# EAGLE design APCBaby8_UIBoard (EAGLE 8.7.0)
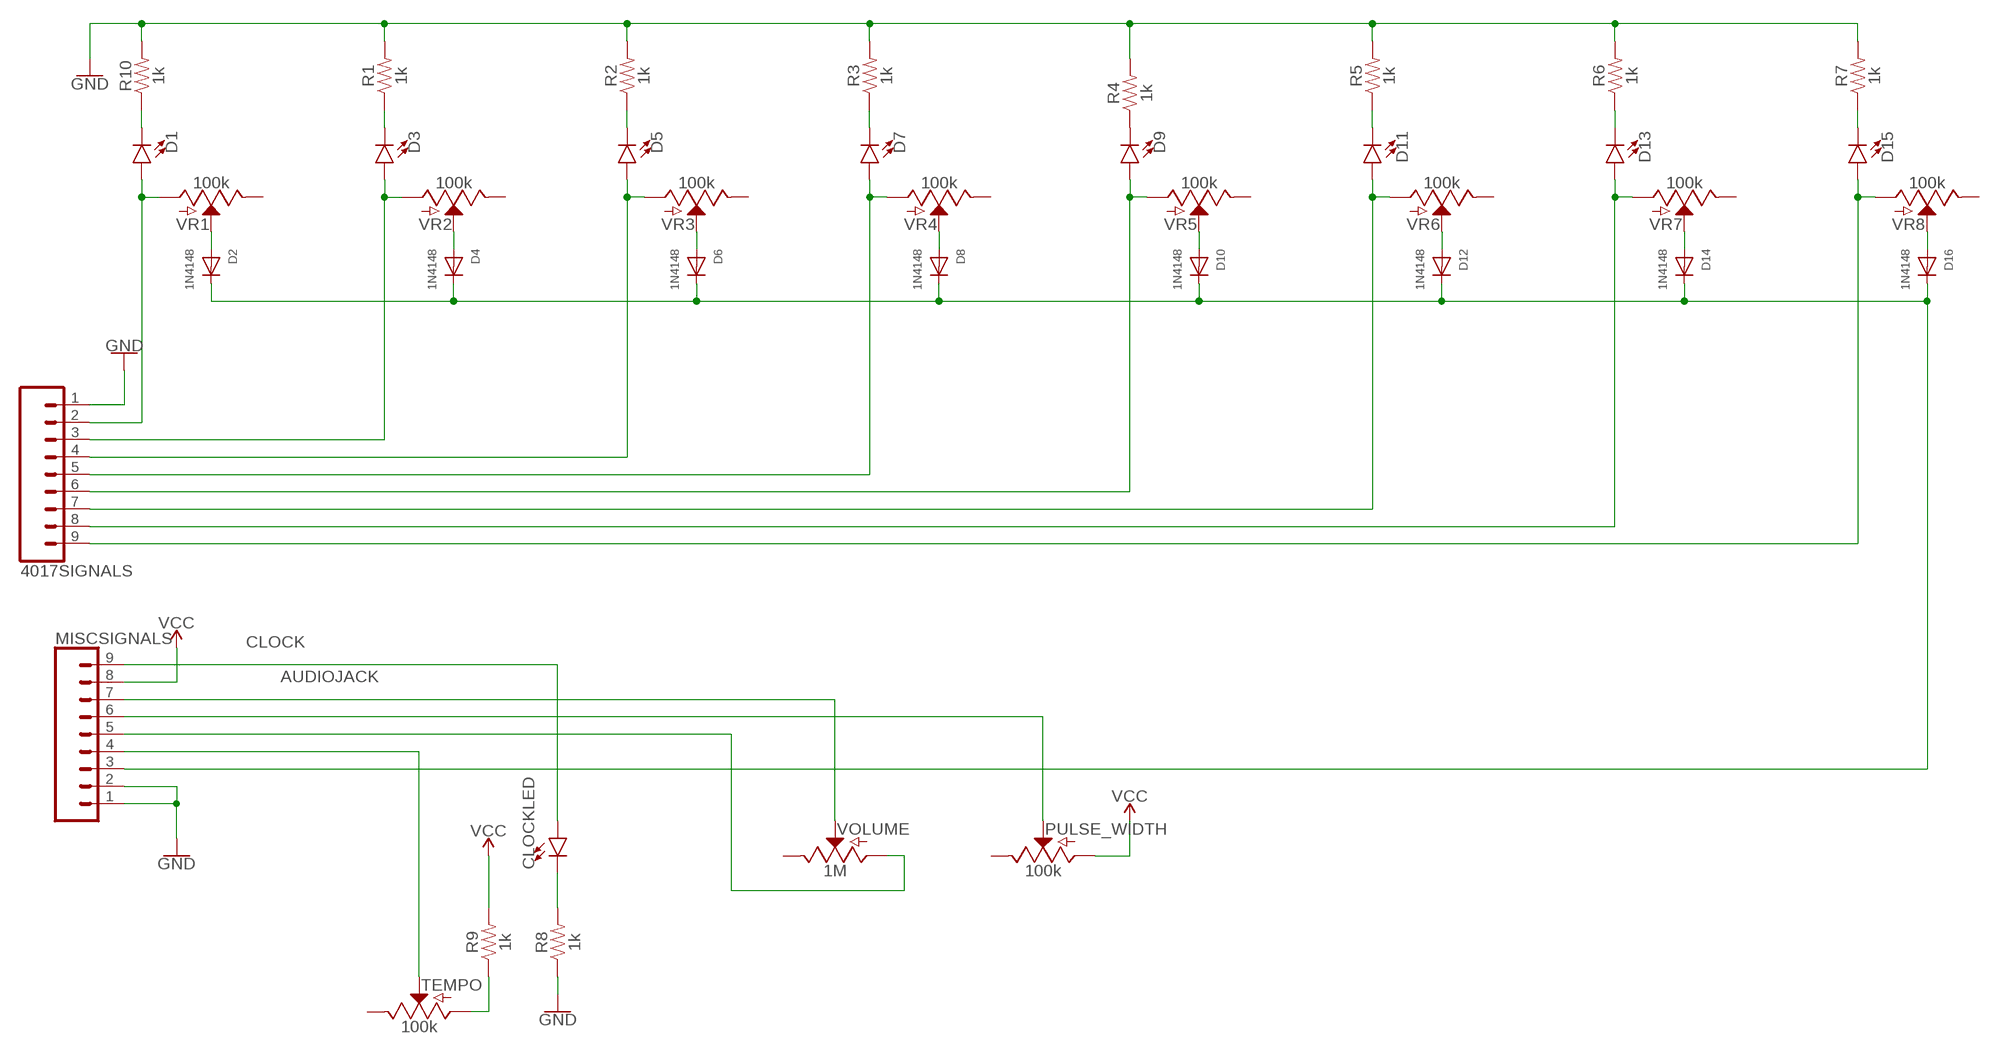
[diagram p0: schematic, sheet 1]

## Parts
4017SIGNALS  CONN_09LONGPADS  [1X09_LONGPADS]
CLOCKLED  LED-3MM-NO_SILK  [LED_3MM-NS]
D1  LED-3MM-NO_SILK  [LED_3MM-NS]
D2  1N4148  DIODEDO-1N4148  [DO-1N4148]
D3  LED-3MM-NO_SILK  [LED_3MM-NS]
D4  1N4148  DIODEDO-1N4148  [DO-1N4148]
D5  LED-3MM-NO_SILK  [LED_3MM-NS]
D6  1N4148  DIODEDO-1N4148  [DO-1N4148]
D7  LED-3MM-NO_SILK  [LED_3MM-NS]
D8  1N4148  DIODEDO-1N4148  [DO-1N4148]
D9  LED-3MM-NO_SILK  [LED_3MM-NS]
D10  1N4148  DIODEDO-1N4148  [DO-1N4148]
D11  LED-3MM-NO_SILK  [LED_3MM-NS]
D12  1N4148  DIODEDO-1N4148  [DO-1N4148]
D13  LED-3MM-NO_SILK  [LED_3MM-NS]
D14  1N4148  DIODEDO-1N4148  [DO-1N4148]
D15  LED-3MM-NO_SILK  [LED_3MM-NS]
D16  1N4148  DIODEDO-1N4148  [DO-1N4148]
MISCSIGNALS  CONN_09LONGPADS  [1X09_LONGPADS]
PULSE_WIDTH  100k  POTENTIOMETER-PTH-9MM-1/20W-20%  [POT-PTH-ALPS]
R1  1k  0.22OHM-0805-1/4W-1%  [0805]
R2  1k  0.22OHM-0805-1/4W-1%  [0805]
R3  1k  0.22OHM-0805-1/4W-1%  [0805]
R4  1k  0.22OHM-0805-1/4W-1%  [0805]
R5  1k  0.22OHM-0805-1/4W-1%  [0805]
R6  1k  0.22OHM-0805-1/4W-1%  [0805]
R7  1k  0.22OHM-0805-1/4W-1%  [0805]
R8  1k  0.22OHM-0805-1/4W-1%  [0805]
R9  1k  0.22OHM-0805-1/4W-1%  [0805]
R10  1k  0.22OHM-0805-1/4W-1%  [0805]
TEMPO  100k  POTENTIOMETER-PTH-9MM-1/20W-20%  [POT-PTH-ALPS]
VOLUME  1M  POTENTIOMETER-PTH-9MM-1/20W-20%  [POT-PTH-ALPS]
VR1  100k  POTENTIOMETER-PTH-9MM-1/20W-20%  [POT-PTH-ALPS]
VR2  100k  POTENTIOMETER-PTH-9MM-1/20W-20%  [POT-PTH-ALPS]
VR3  100k  POTENTIOMETER-PTH-9MM-1/20W-20%  [POT-PTH-ALPS]
VR4  100k  POTENTIOMETER-PTH-9MM-1/20W-20%  [POT-PTH-ALPS]
VR5  100k  POTENTIOMETER-PTH-9MM-1/20W-20%  [POT-PTH-ALPS]
VR6  100k  POTENTIOMETER-PTH-9MM-1/20W-20%  [POT-PTH-ALPS]
VR7  100k  POTENTIOMETER-PTH-9MM-1/20W-20%  [POT-PTH-ALPS]
VR8  100k  POTENTIOMETER-PTH-9MM-1/20W-20%  [POT-PTH-ALPS]

## Nets
AUDIOJACK: MISCSIGNALS.7 VOLUME.P$2(S)
CLOCK: CLOCKLED.A MISCSIGNALS.9
GND: 4017SIGNALS.1 MISCSIGNALS.1 MISCSIGNALS.2 R1.2 R2.2 R3.2 R4.2 R5.2 R6.2 R7.2 R8.1 R10.2
N$1: D9.K(C) R4.1
N$2: D2.A VR1.P$2(S)
N$3: D1.K(C) R10.1
N$4: D4.A VR2.P$2(S)
N$5: D3.K(C) R1.1
N$6: R9.1 TEMPO.P$3(A)
N$8: D6.A VR3.P$2(S)
N$9: D5.K(C) R2.1
N$11: D8.A VR4.P$2(S)
N$12: D7.K(C) R3.1
N$15: D10.A VR5.P$2(S)
N$18: D12.A VR6.P$2(S)
N$19: D11.K(C) R5.1
N$22: D14.A VR7.P$2(S)
N$23: D13.K(C) R6.1
N$25: D16.A VR8.P$2(S)
N$26: D15.K(C) R7.1
N$29: CLOCKLED.K(C) R8.2
PULSESIG: MISCSIGNALS.6 PULSE_WIDTH.P$2(S)
STEP1: 4017SIGNALS.2 D1.A VR1.P$3(A)
STEP2: 4017SIGNALS.3 D3.A VR2.P$3(A)
STEP3: 4017SIGNALS.4 D5.A VR3.P$3(A)
STEP4: 4017SIGNALS.5 D7.A VR4.P$3(A)
STEP5: 4017SIGNALS.6 D9.A VR5.P$3(A)
STEP6: 4017SIGNALS.7 D11.A VR6.P$3(A)
STEP7: 4017SIGNALS.8 D13.A VR7.P$3(A)
STEP8: 4017SIGNALS.9 D15.A VR8.P$3(A)
STEPDIODES: D2.C D4.C D6.C D8.C D10.C D12.C D14.C D16.C MISCSIGNALS.3
TEMPOSIG: MISCSIGNALS.4 TEMPO.P$2(S)
VCC: MISCSIGNALS.8 PULSE_WIDTH.P$3(A) R9.2
VOLSIG: MISCSIGNALS.5 VOLUME.P$3(A)
Unconnected: PULSE_WIDTH.P$1(E) TEMPO.P$1(E) VOLUME.P$1(E) VR1.P$1(E) VR2.P$1(E) VR3.P$1(E) VR4.P$1(E) VR5.P$1(E) VR6.P$1(E) VR7.P$1(E) VR8.P$1(E)

## Library data of the parts
4017SIGNALS MISCSIGNALS = SparkFun-Connectors:CONN_09: Multi connection point. Often used as Generic Header-pin footprint for 0.1 inch spaced/style header connections On any of the 0.1 inch spaced packages, you can populate with these: Break Away Headers - Straight <https://www.sparkfun.com/products/116> (PRT-00116) Break Away Male Headers - Right Angle <https://www.sparkfun.com/products/553> (PRT-00553) Female Headers <https://www.sparkfun.com/products/115> (PRT-00115) Break Away Headers - Machine Pin <https://www.sparkfun.com/products/117> (PRT-00117) Break Away Female Headers - Swiss Machine Pin <https://www.sparkfun.com/products/743> (PRT-00743) For SCREWTERMINALS and SPRING TERMINALS visit here: Screw Terimnals on SparkFun.com <https://www.sparkfun.com/search/results?term=Screw+Terminals> (5mm/3.5mm/2.54mm spacing) This device is also useful as a general connection point to wire up your design to another part of your project. Our various solder wires solder well into these plated through hole pads. Hook-Up Wire - Assortment (Stranded, 22 AWG) <https://www.sparkfun.com/products/11375> (PRT-11375) Hook-Up Wire - Assortment (Solid Core, 22 AWG) <https://www.sparkfun.com/products/11367> (PRT-11367) View the entire wire category on our website here <https://www.sparkfun.com/categories/141> Special notes: Molex polarized connector foot print use with SKU : PRT-08231 with associated crimp pins and housings. 1MM SMD Version SKU: PRT-10208 NOTES ON THE VARIANTS LOCK and LOCK_LONGPADS... This footprint was designed to help hold the alignment of a through-hole component (i.e. 6-pin header) while soldering it into place. You may notice that each hole has been shifted either up or down by 0.005 of an inch from it's more standard position (which is a perfectly straight line). This slight alteration caused the pins (the squares in the middle) to touch the edges of the holes. Because they are alternating, it causes a "brace" to hold the component in place. 0.005 has proven to be the perfect amount of "off-center" position when using our standard breakaway headers. Although looks a little odd when you look at the bare footprint, once you have a header in there, the alteration is very hard to notice. Also,if you push a header all the way into place, it is covered up entirely on the bottom side.
CLOCKLED D1 D3 D5 D7 D9 D11 D13 D15 = SparkFun-LED:LED: LED (Generic) Standard schematic elements and footprints for 5mm, 3mm, 1206, and 0603 sized LEDs. Generic LEDs with no color specified.
D2 D4 D6 D8 D10 D12 D14 D16 = adafruit:DIODE: Diode SMADIODE - SMA Surface Mount Package 20V 1A Schottky Diode Digikey: 641-1014-6-ND DO-1N4148 - Through Hole Small Current Diode SOD-123 20V 1 A (.5mV Vf) Schottky Diode - Digikey: MBRX120TPMSCT-ND SOD-323 10V 570mA (.38mV Vf, 3ns) Schottky Diode - Digikey: ZLLS410CT-ND SOD-523 30V 30mA Schottky Diode (RB751S-40TE61) - Digikey: RB751S-40TE61CT-ND SOT23-R/W - SOT23 Package (R = Solder Paste/Reflow Ovens, W = Hand-Soldering) BAT54Film 40V 300mA - Digikey: 497-7162-1-ND
PULSE_WIDTH TEMPO VOLUME VR1-VR8 = SparkFun-Resistors:POTENTIOMETER: Potentiometer (Pot) Three-terminal potentiometers, with an adjustable wiper and two adjustable resistors. A pot can be used to create a configurable voltage divider, or as a variable resistor. Variants ALPS_POT and ALPS_POT_KIT - PTH, breadboard compatible, 9mm square pots Rotary Potentiometer - Linear (10k ohm) <https://www.sparkfun.com/products/9288> (COM-09288) The KIT variant exposes copper on only one side of the PTH pad, so the part can only be assembled on one side of the PCB. Useful for beginner soldering kits.; PROD_ID: RES-09177; SF_SKU: COM-09288; VALUE: 10k
R1-R10 = SparkFun-Resistors:0.22OHM: 0.22Ω resistor A resistor is a passive two-terminal electrical component that implements electrical resistance as a circuit element. Resistors act to reduce current flow, and, at the same time, act to lower voltage levels within circuits. - Wikipedia; PROD_ID: RES-09883; VALUE: 0.22

## Board
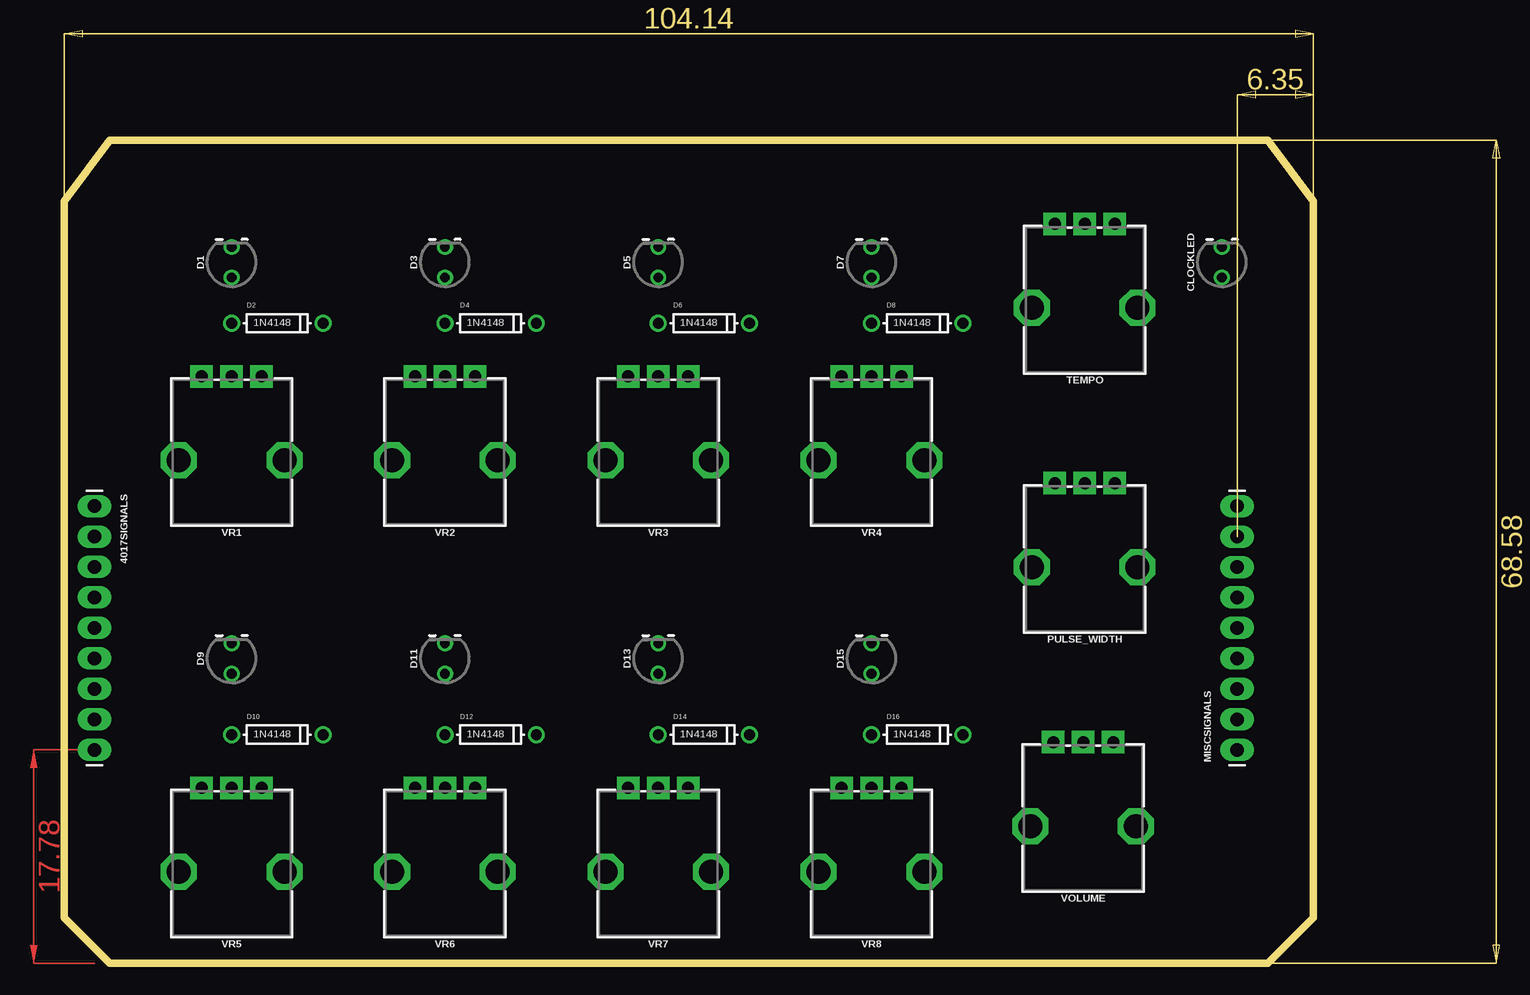
[diagram p1: board, top side]
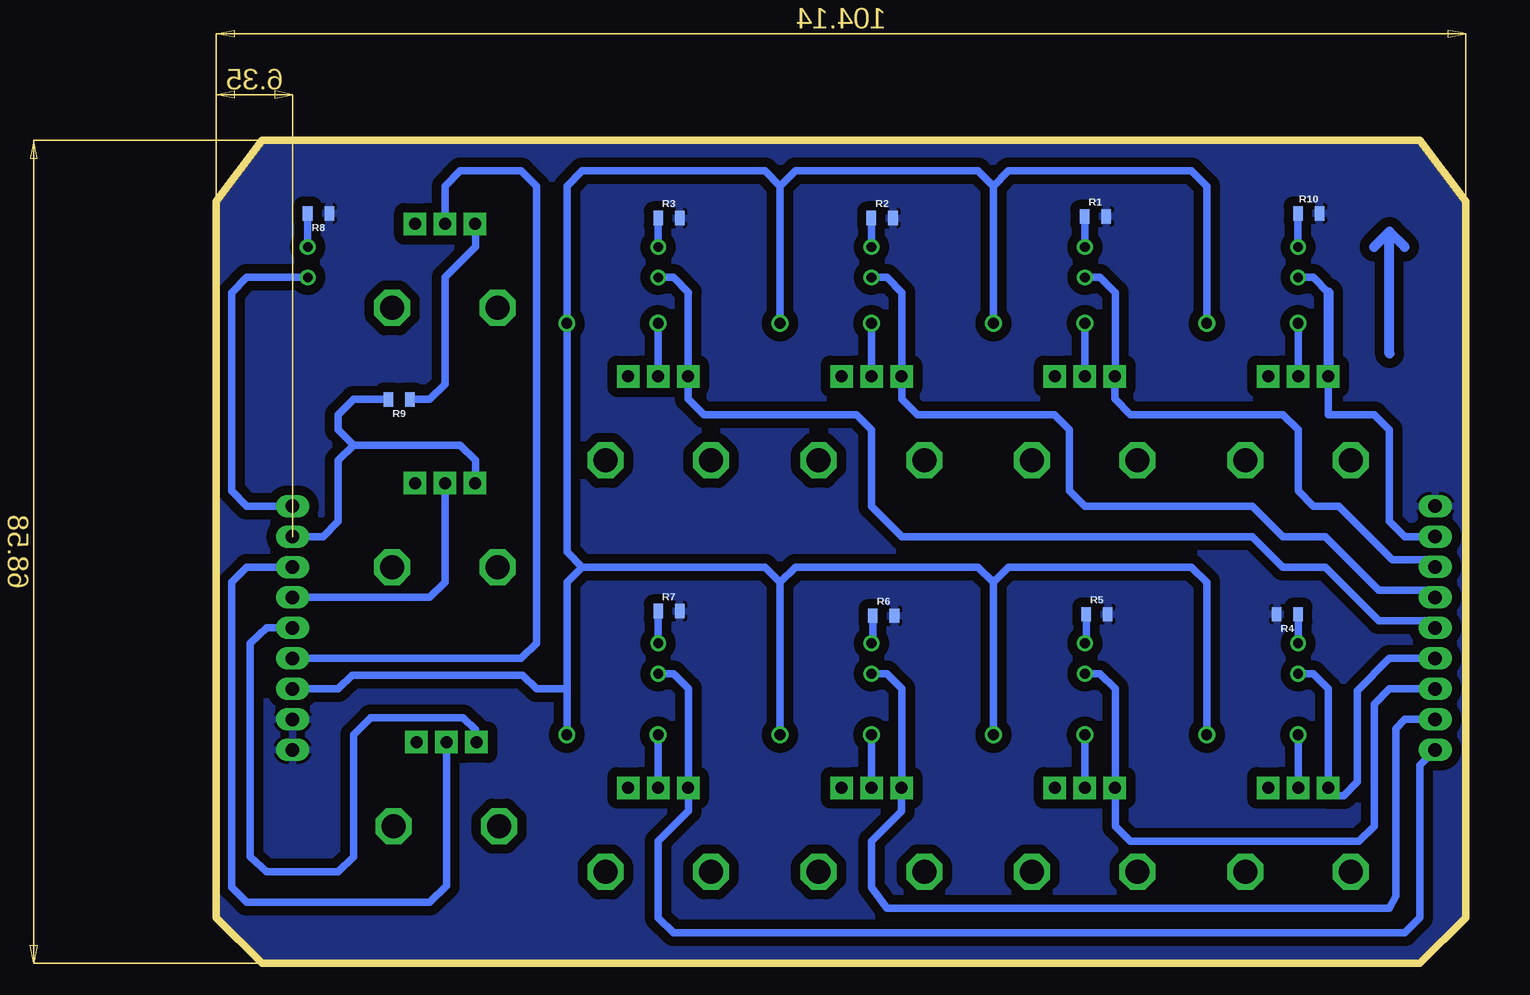
[diagram p2: board, bottom side, seen from below]

Size 104.14 x 68.58 mm. Coordinates in mm from the lower left corner, seen from the top.
Outline: 0,63.5 0,3.81 3.81,0 100.33,0 104.14,3.81 104.14,63.5 100.33,68.58 3.81,68.58 0,63.5
Copper layers (1*16): Top 0.035mm / dielectric 1.5mm / Bottom 0.035mm
Design rules "OthermillDRC_1_32_v2": minimum track width 8mil, minimum drill 0.8mm, track to track 0.794003125mm, track to pad 0.794003125mm, pad to pad 0.794003125mm, via to via 0.794003125mm, smd to smd 0mil, copper to edge 0mil, drill to drill 1mil, minimum pad ring 10mil, minimum via ring 10mil, stop-mask expansion 1mil, vias tented up to drill 30mil, thermal gap 10mil

### Footprints (pad centres in the part's own frame; a part is rotated, then mirrored left to right if it is on the bottom)
1X09_LONGPADS = drill 1.118 pad 1.88 long: 1 0,0; 2 2.54,0; 3 5.08,0; 4 7.62,0; 5 10.16,0; 6 12.7,0; 7 15.24,0; 8 17.78,0; 9 20.32,0
LED_3MM-NS = drill 0.813: A -1.27,0; K 1.27,0
DO-1N4148 = drill 0.9: A -3.81,0; C 3.81,0
POT-PTH-ALPS = drill 1 pad 1.88 square: P$1 7,-2.5; P$2 7,0; P$3 7,2.5 | drill 2 octagon: P$4 0,-4.4; P$5 0,4.4
0805 = smd 0.8 x 1.2: 1 -0.9,0; 2 0.9,0

### Placement (x,y rotation side)
4017SIGNALS  2.54,38.1 270 top
CLOCKLED  96.52,58.42 90 top
D1  13.97,58.42 90 top
D2  17.78,53.34 0 top
D3  31.75,58.42 90 top
D4  35.56,53.34 0 top
D5  49.53,58.42 90 top
D6  53.34,53.34 0 top
D7  67.31,58.42 90 top
D8  71.12,53.34 0 top
D9  13.97,25.4 90 top
D10  17.78,19.05 0 top
D11  31.75,25.4 90 top
D12  35.56,19.05 0 top
D13  49.53,25.4 90 top
D14  53.34,19.05 0 top
D15  67.31,25.4 90 top
D16  71.12,19.05 0 top
MISCSIGNALS  97.79,17.78 90 top
PULSE_WIDTH  85.09,33.02 90 top
R1  30.86,62.23 0 bottom
R2  48.64,62.1 0 bottom
R3  66.42,62.1 0 bottom
R4  14.86,29.08 180 bottom
R5  30.73,29.08 0 bottom
R6  48.51,28.96 0 bottom
R7  66.42,29.34 0 bottom
R8  95.63,62.48 180 bottom
R9  88.9,46.99 180 bottom
R10  13.08,62.48 0 bottom
TEMPO  85.09,54.61 90 top
VOLUME  84.96,11.43 90 top
VR1  13.97,41.91 90 top
VR2  31.75,41.91 90 top
VR3  49.53,41.91 90 top
VR4  67.31,41.91 90 top
VR5  13.97,7.62 90 top
VR6  31.75,7.62 90 top
VR7  49.53,7.62 90 top
VR8  67.31,7.62 90 top

### Tracks (layer width: path | path; a pad name or v marks a point on that pad's centre or on a via)
AUDIOJACK
  Bottom 0.61: MISCSIGNALS.7 101.6,33.02 102.87,31.75 102.87,6.35 101.6,5.08 86.36,5.08 84.96,6.48 VOLUME.P$2
CLOCK
  Bottom 0.61: CLOCKLED.A 101.6,57.15 102.87,55.88 102.87,39.37 101.6,38.1 MISCSIGNALS.9
GND
  pour Bottom: 0,63.5 0,3.81 3.81,0 100.33,0 104.14,3.81 104.14,63.5 100.33,68.58 3.81,68.58
N$1
  Bottom 0.61: D9.K 13.96,26.68 R4.1
N$2
  Bottom 0.61: D2.A VR1.P$2
N$3
  Bottom 0.61: R10.1 13.98,59.7 D1.K
N$4
  Bottom 0.61: D4.A VR2.P$2
N$5
  Bottom 0.61: 31.79,59.73 D3.K 31.76,59.7 R1.1
N$6
  Bottom 0.61: R9.1 86.36,46.99 85.09,48.26 85.09,57.15 82.55,59.69 82.55,61.57 TEMPO.P$3
N$7
  Bottom 0.813: 6.35,50.8 6.35,60.96 | 6.35,60.96 7.62,59.69 | 6.35,60.96 5.08,59.69
N$8
  Bottom 0.61: D6.A VR3.P$2
N$9
  Bottom 0.61: R2.1 49.54,59.7 D5.K
N$11
  Bottom 0.61: D8.A VR4.P$2
N$12
  Bottom 0.61: R3.1 67.32,59.7 D7.K
N$15
  Bottom 0.61: VR5.P$2 D10.A
N$18
  Bottom 0.61: D12.A VR6.P$2
N$19
  Bottom 0.61: D11.K 31.63,26.79 R5.1
N$22
  Bottom 0.61: VR7.P$2 D14.A
N$23
  Bottom 0.61: 49.49,26.71 D13.K 49.41,26.79 R6.1
N$25
  Bottom 0.61: VR8.P$2 D16.A
N$26
  Bottom 0.61: 67.27,26.71 D15.K 67.31,29.33 R7.1
N$29
  Bottom 0.61: R8.2 96.53,59.7 CLOCKLED.K
PULSESIG
  Bottom 0.61: MISCSIGNALS.6 86.36,30.48 85.09,31.75 PULSE_WIDTH.P$2
STEP1
  Bottom 0.61: 4017SIGNALS.2 5.08,35.56 6.35,36.83 6.35,44.45 7.62,45.72 11.43,45.72 11.47,47.03 VR1.P$3 11.43,48.95 | D1.A 12.7,57.15 11.43,55.88
  Bottom 0.813: 11.43,55.88 11.43,48.95
STEP2
  Bottom 0.61: 4017SIGNALS.3 3.14,33.62 6.11,33.62 10.59,38.1 12.7,38.1 13.97,39.37 13.97,44.45 15.24,45.72 27.94,45.72 29.25,47.03 VR2.P$3 29.21,48.95 29.21,55.88 30.48,57.15 D3.A
STEP3
  Bottom 0.61: VR3.P$3 46.99,48.95 | 46.99,48.95 46.99,55.88 48.26,57.15 D5.A | 46.99,48.95 46.99,46.99 45.72,45.72 34.29,45.72 33.02,44.45 33.02,39.37 31.75,38.1 17.78,38.1 15.24,35.56 11.71,35.56 7.23,31.08 3.14,31.08 4017SIGNALS.4
STEP4
  Bottom 0.61: D7.A 66.04,57.15 64.77,55.88 64.81,55.84 VR4.P$3 64.81,47.03 63.5,45.72 50.8,45.72 49.53,44.45 49.53,38.1 46.99,35.56 17.78,35.56 15.24,33.02 11.71,33.02 7.23,28.54 3.14,28.54 4017SIGNALS.5
STEP5
  Bottom 0.61: 4017SIGNALS.6 6.35,25.4 9.02,22.73 9.02,15.11 10.16,13.97 11.43,13.97 11.47,14.01 VR5.P$3 11.47,22.82 11.43,22.86 12.7,24.13 D9.A
STEP6
  Bottom 0.61: 4017SIGNALS.7 6.35,22.86 7.62,21.59 7.62,11.43 8.89,10.16 27.94,10.16 29.21,11.43 29.21,14.58 VR6.P$3 29.21,14.66 29.21,22.86 30.48,24.13 D11.A
STEP7
  Bottom 0.61: 4017SIGNALS.8 5.08,20.32 5.84,19.56 5.84,5.59 6.35,4.57 48.26,4.57 49.53,6.35 49.53,10.16 47.03,12.66 VR7.P$3 46.99,14.66 46.99,22.86 48.26,24.13 D13.A
STEP8
  Bottom 0.61: 64.77,14.58 64.77,12.7 67.31,10.16 67.31,3.81 66.04,2.54 5.08,2.54 3.81,3.81 3.81,16.51 4017SIGNALS.9 | 64.77,14.58 VR8.P$3 | D15.A 66.04,24.13 64.77,22.86 64.77,14.58
STEPDIODES
  Bottom 0.61: 96.52,22.86 MISCSIGNALS.3 93.98,22.86 92.84,24 78.61,24 77.47,22.86 74.93,22.86 | D10.C 21.59,31.75 22.86,33.02 38.1,33.02 39.37,31.75 | 39.37,31.75 D12.C | 39.37,31.75 40.64,33.02 55.88,33.02 57.15,31.75 | 57.15,31.75 D14.C | 57.15,31.75 58.42,33.02 73.66,33.02 | 73.66,33.02 74.93,31.75 74.93,22.86 | 74.93,22.86 D16.C | D2.C 21.59,64.77 22.86,66.04 38.1,66.04 39.37,64.77 | 39.37,64.77 D4.C | 39.37,64.77 40.64,66.04 55.88,66.04 57.15,64.77 | 57.15,64.77 D6.C | 57.15,64.77 58.42,66.04 73.66,66.04 74.93,64.77 D8.C 74.93,34.29 73.66,33.02
TEMPOSIG
  Bottom 0.61: MISCSIGNALS.4 78.74,25.4 77.47,26.67 77.47,64.77 78.74,66.04 83.82,66.04 85.09,64.77 TEMPO.P$2
VCC
  Bottom 0.61: MISCSIGNALS.8 95.25,35.56 93.98,36.83 93.98,41.91 92.71,43.18 | 92.71,43.18 83.82,43.18 82.55,41.91 82.55,40.06 PULSE_WIDTH.P$3 | 92.71,43.18 93.98,44.45 93.98,45.72 92.71,46.99 R9.2
VOLSIG
  Bottom 0.61: MISCSIGNALS.5 99.95,27.94 101.35,26.67 101.35,8.89 99.95,7.62 93.98,7.62 92.71,8.89 92.71,19.05 91.29,20.47 83.57,20.47 82.55,19.45 82.55,18.52 VOLUME.P$3
(copper drawn outside any net)
  shapes: Top area x1